# Altium schematic sheet MCU_IO.SchDoc
size A
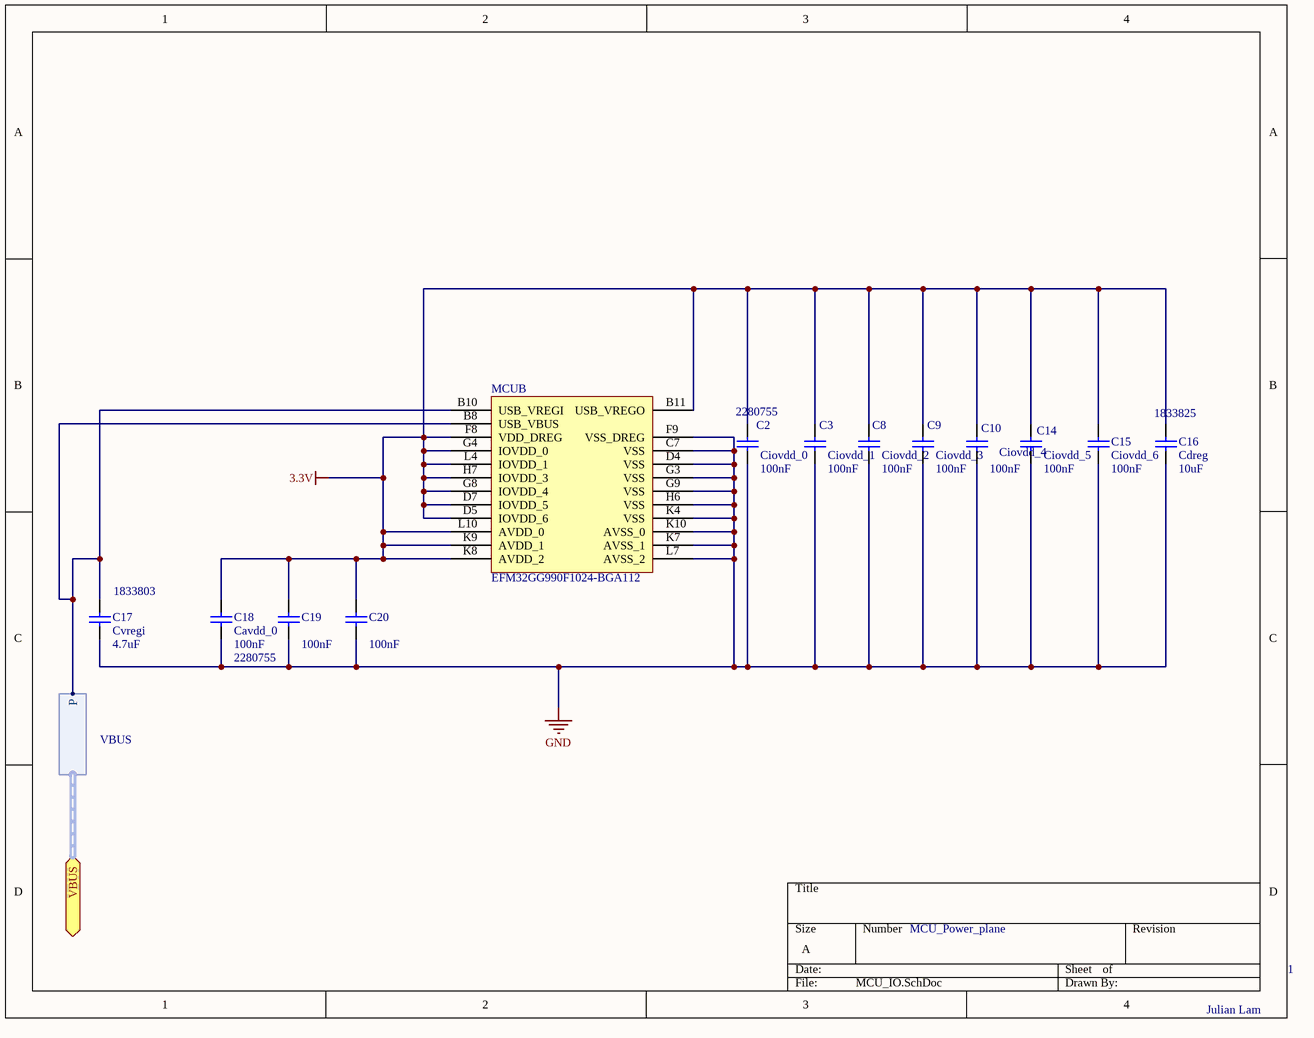
[diagram p0: MCU_IO.SchDoc]

## Parts
C2  Ciovdd_0  value 100nF  Supplier Part Number 1: 2280755  [C1206]
C3  Ciovdd_1  value 100nF  [C1206]
C8  Ciovdd_2  value 100nF  [C1206]
C9  Ciovdd_3  value 100nF  [C1206]
C10  Ciovdd_4  value 100nF  [C1206]
C14  Ciovdd_5  value 100nF  [C1206]
C15  Ciovdd_6  value 100nF  [C1206]
C16  Cdreg  value 10uF  Supplier Part Number 1: 1833825  [C1206]
C17  Cvregi  value 4.7uF  Supplier Part Number 1: 1833803  [C1206]
C18  Cavdd_0  value 100nF  Supplier Part Number 1: 2280755  [C1206]
C19  value 100nF  [C1206]  (hidden comment: Cavdd_1)
C20  value 100nF  [C1206]  (hidden comment: Cavdd_2)
MCU  EFM32GG990F1024-BGA112  [ENMR-BGA112]  (part B of 2)

## Ports
VBUS (harness VBUS)

## Harnesses
VBUS: P

## Nets
3.3V: C2.2 C3.2 C8.2 C9.2 C10.2 C14.2 C15.2 C16.2 C18.2 C19.2 C20.1 MCU.B11(USB_VREGO) MCU.D5(IOVDD_6) MCU.D7(IOVDD_5) MCU.F8(VDD_DREG) MCU.G4(IOVDD_0) MCU.G8(IOVDD_4) MCU.H7(IOVDD_3) MCU.K8(AVDD_2) MCU.K9(AVDD_1) MCU.L4(IOVDD_1) MCU.L10(AVDD_0)
GND: C2.1 C3.1 C8.1 C9.1 C10.1 C14.1 C15.1 C16.1 C17.1 C18.1 C19.1 C20.2 MCU.C7(VSS) MCU.D4(VSS) MCU.F9(VSS_DREG) MCU.G3(VSS) MCU.G9(VSS) MCU.H6(VSS) MCU.K4(VSS) MCU.K7(AVSS_1) MCU.K10(AVSS_0) MCU.L7(AVSS_2)
NetC17_2: C17.2 MCU.B8(USB_VBUS) MCU.B10(USB_VREGI) ; port VBUS.P

## Notes on the sheet
- MCU_Power_plane
- 1
- Julian Lam

## Library data of the parts
C2 C3 C8-C10 C14 C15 C18-C20 = Cap Semi: Capacitor (Semiconductor SIM Model); Manufacturer: AVX; Manufacturer Part Number: 02016D104KAT2A; Capacitance: 0.1; Capacitance Tolerance: ± 10%; Dielectric Characteristic: X5; Voltage Rating: 6.3; Ceramic Capacitor Case: 0201 [0603 Metric]; SVHC: No SVHC (16-Dec-2013); Capacitor Terminals: SMD; Reel Quantity: 15000; Published: 8-Jun-2000; LatestRevisionDate: 29-May-2009; LatestRevisionNote: IPC-7351 Footprint Added.; PackageReference: C1206; Publisher: Altium Limited; PackageDescription: Chip Capacitor; Supplier 1: Farnell; RoHS: YES; Stock 1: 30000; Pricing 1: 15000=0.0827, 75000=0.062, 150000=0.0517 (EUR); Product Range: -; Operating Temperature Min: -55; Operating Temperature Max: 85; Packaging: Tape & Reel; MSL: MSL 1 - Unlimited; Capacitance Tolerance ±: ± 10%; Capacitor Case Style: 0201 [0603 Metric]; Operating Temperature Range: -55°C to +85; ComponentLink1URL: http://www.farnell.com/datasheets/1666675.pdf; ComponentLink1Description: http://www.farnell.com/datasheets/1666675.pdf
  C3 C8-C10 C14 C15 C19 C20: Supplier Part Number 1: 2280755
C16 = Cap Semi: Capacitor (Semiconductor SIM Model); Manufacturer: AVX; Manufacturer Part Number: 12063D106KAT2A; Capacitance: 10; Capacitance Tolerance: ± 10%; Dielectric Characteristic: X5; Voltage Rating: 25; Ceramic Capacitor Case: 1206 [3216 Metric]; SVHC: No SVHC (16-Dec-2013); Capacitor Terminals: SMD; Published: 8-Jun-2000; LatestRevisionDate: 29-May-2009; LatestRevisionNote: IPC-7351 Footprint Added.; PackageReference: C1206; Publisher: Altium Limited; PackageDescription: Chip Capacitor; Supplier 1: Farnell; RoHS: YES; Stock 1: 16889; Pricing 1: 10=3.58, 100=2.42, 500=1.21, 1000=1, 2000=0.8 (EUR); Product Range: -; Operating Temperature Min: -55; Operating Temperature Max: 85; Packaging: Cut Tape; MSL: MSL 1 - Unlimited; Capacitance Tolerance ±: ± 10%; Capacitor Case Style: 1206 [3216 Metric]; Operating Temperature Range: -55°C to +85; Series: Hi-Cap MLCC<!--FANDB--><div class="features-and-benefits-container"></div>; ComponentLink1URL: http://www.farnell.com/datasheets/1796776.pdf; ComponentLink1Description: http://www.farnell.com/datasheets/1796776.pdf
C17 = Cap Semi: Capacitor (Semiconductor SIM Model); Manufacturer: AVX; Manufacturer Part Number: 06036D475KAT2A; Published: 8-Jun-2000; LatestRevisionDate: 29-May-2009; LatestRevisionNote: IPC-7351 Footprint Added.; PackageReference: C1206; Publisher: Altium Limited; PackageDescription: Chip Capacitor; Supplier 1: Farnell; RoHS: YES; Stock 1: 17276; Pricing 1: 10=1.65, 100=1.02, 500=0.44, 1000=0.36, 2000=0.29 (EUR); ComponentLink1URL: http://www.farnell.com/datasheets/1796776.pdf; ComponentLink1Description: http://www.farnell.com/datasheets/1796776.pdf
MCU = CMP-0270-00024-1: EFM32 Giant Gecko, M3 ARM Cortex CPU, 1024 KB Flash, 128 KB RAM, 1.85 - 3.8 V Supply, 48 MHz Max Speed, -40 to 85 degC, 112-Pin BGA, RoHS Compliant; LESENSE: Y; RAM (KB): 128; Flash (KB): 1024; LCD: 8x34; OPAMPS: 3; GPIO: 87; Max Speed (MHz): 48; ARM Cortex CPU: M3; DatasheetVersion: Rev 1.00; PartNumber: EFM32GG990F1024-BGA112; ComponentLink3Description: Package Specification; Subcategory: EFM32 Giant Gecko; PackageReference: BGA112; ComponentLink3URL: http://cdn.energymicro.com/dl/devices/pdf/d0007_efm32g290_datasheet.pdf; ComponentLink2Description: Datasheet; USB: Y; PackageDescription: 112-Pin Ball Grid Array, Body 10 x 10 mm, Pitch 0.8 mm; PackageVersion: Rev. 97SPP01315A_X03_06Jun11; ComponentLink1Description: Manufacturer URL; Supply Voltage (V): 1.85 - 3.8; Mounting Technology: Surface Mount; ComponentLink1URL: http://www.energymicro.com/; Generic Part Number: EFM32GG990; ComponentLink2URL: http://cdn.energymicro.com/dl/devices/pdf/d0046_efm32gg990_datasheet.pdf